# EAGLE design zigduino-v6c-test (EAGLE 6.3)
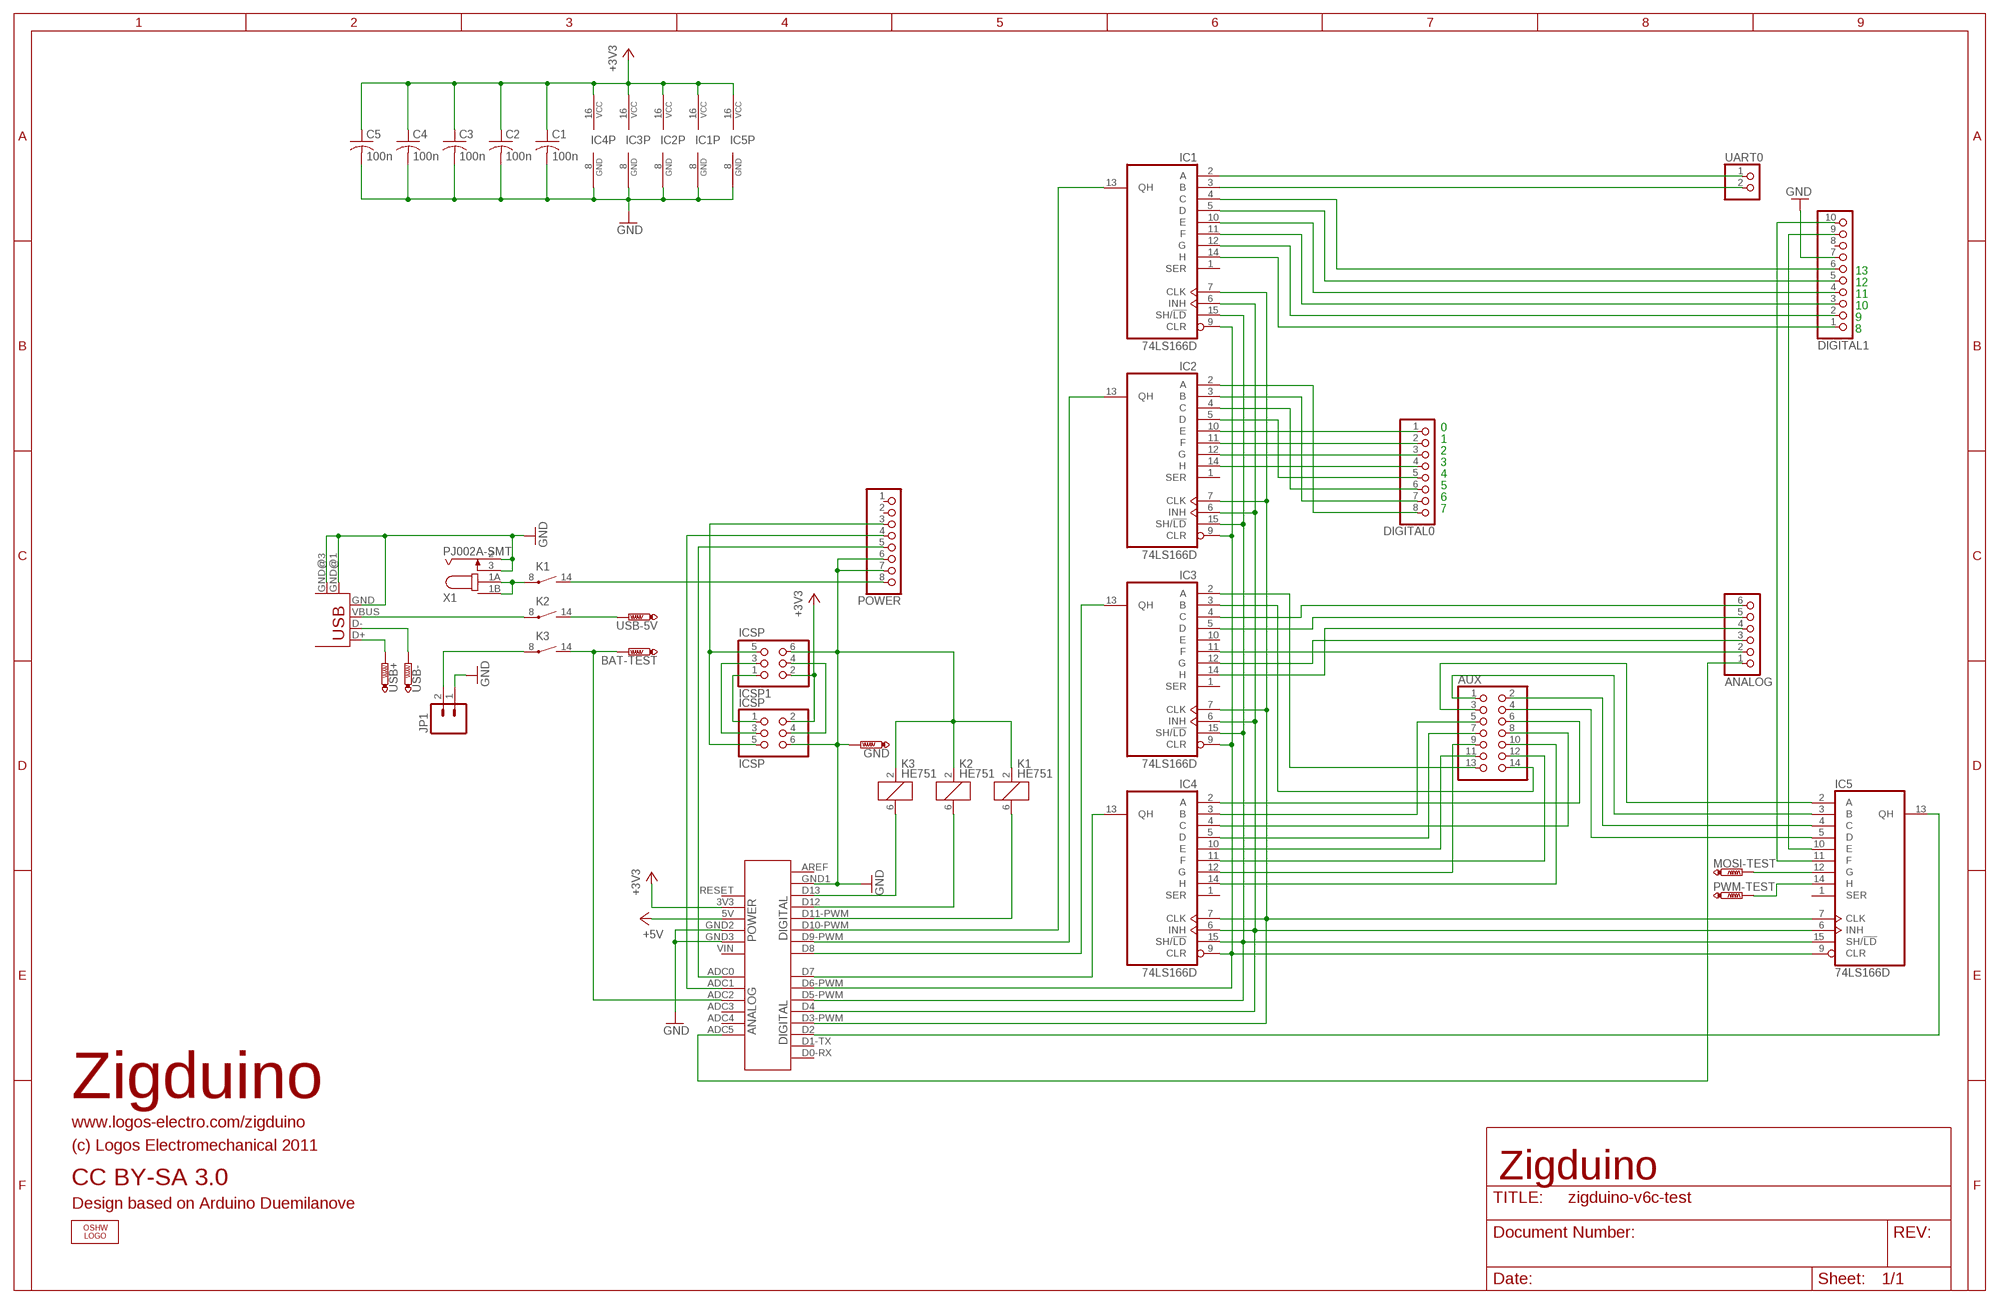
[diagram p0: schematic, sheet 1]

## Parts
ANALOG  PINHD-1X6  [1X06]
AUX  PINHD-2X7_2.00  [2X07M]
BAT-TEST  PTR1PAD1-13  [P1-13]
C1  100n  C-USC0603  [C0603]
C2  100n  C-USC0603  [C0603]
C3  100n  C-USC0603  [C0603]
C4  100n  C-USC0603  [C0603]
C5  100n  C-USC0603  [C0603]
DIGITAL0  PINHD-1X8  [1X08]
DIGITAL1  PINHD-1X10  [1X10]
GND  PTR1PAD1-13  [P1-13]
IC1  74LS166D  [SO16]
IC2  74LS166D  [SO16]
IC3  74LS166D  [SO16]
IC4  74LS166D  [SO16]
IC5  74LS166D  [SO16]
ICSP  ICSP  PINHD-2X3  [2X03]
ICSP1  ICSP  PINHD-2X3  [2X03]
JP1  M02-JST-2MM-SMT  [S2B-PH]
K1  HE751  [HE751]
K2  HE751  [HE751]
K3  HE751  [HE751]
LOGO1  OSHW_LOGO_FILLX0200-NT  [OSHW_FILLX200_NOTEXT]
MOSI-TEST  PTR1PAD1-13  [P1-13]
POWER  PINHD-1X8  [1X08]
PWM-TEST  PTR1PAD1-13  [P1-13]
SHIELD1  2009  [2009]
UART0  PINHD-1X2  [1X02]
USB1  USB-MB-S  [USB-MB-S]
USB+  PTR1PAD1-13  [P1-13]
USB-  PTR1PAD1-13  [P1-13]
USB-5V  PTR1PAD1-13  [P1-13]
X1  PJ002A-SMT  [PJ002A-SMT]

## Nets
+3V3: C1.1 C2.1 C3.1 C4.1 C5.1 IC1.16(VCC) IC2.16(VCC) IC3.16(VCC) IC4.16(VCC) IC5.16(VCC) ICSP1.2 ICSP.2 SHIELD1.3V3
+5V: SHIELD1.5V
GND: C1.2 C2.2 C3.2 C4.2 C5.2 DIGITAL1.7 GND.TP IC1.8(GND) IC2.8(GND) IC3.8(GND) IC4.8(GND) IC5.8(GND) ICSP1.6 ICSP.6 JP1.1 K1.2 K2.2 K3.2 POWER.6 POWER.7 SHIELD1.GND1 SHIELD1.GND2 SHIELD1.GND3 USB1.GND USB1.GND@1(GND) USB1.GND@3(GND) X1.2 X1.3
N$1: IC1.2(A) UART0.1
N$2: IC1.3(B) UART0.2
N$3: JP1.2 K3.8(2:P)
N$4: DIGITAL1.6 IC1.4(C)
N$5: DIGITAL1.5 IC1.5(D)
N$6: DIGITAL1.4 IC1.10(E)
N$7: DIGITAL1.3 IC1.11(F)
N$8: DIGITAL1.2 IC1.12(G)
N$9: DIGITAL1.1 IC1.14(H)
N$10: DIGITAL0.4 IC2.14(H)
N$11: DIGITAL0.3 IC2.12(G)
N$12: DIGITAL0.2 IC2.11(F)
N$13: DIGITAL0.1 IC2.10(E)
N$14: DIGITAL0.5 IC2.5(D)
N$15: DIGITAL0.6 IC2.4(C)
N$16: DIGITAL0.7 IC2.3(B)
N$17: DIGITAL0.8 IC2.2(A)
N$18: ANALOG.1 SHIELD1.ADC5
N$19: ANALOG.6 IC3.4(C)
N$20: ANALOG.5 IC3.5(D)
N$21: ANALOG.4 IC3.14(H)
N$22: ANALOG.3 IC3.12(G)
N$23: ANALOG.2 IC3.11(F)
N$24: AUX.13 IC3.2(A)
N$25: AUX.14 IC3.3(B)
N$26: AUX.6 IC4.2(A)
N$27: AUX.5 IC4.3(B)
N$28: AUX.8 IC4.4(C)
N$29: AUX.7 IC4.5(D)
N$30: AUX.11 IC4.10(E)
N$31: AUX.12 IC4.11(F)
N$32: AUX.9 IC4.12(G)
N$33: AUX.3 IC5.2(A)
N$34: AUX.10 IC4.14(H)
N$35: AUX.2 IC5.4(C)
N$36: AUX.4 IC5.5(D)
N$37: AUX.1 IC5.3(B)
N$38: IC1.9(CLR) IC2.9(CLR) IC3.9(CLR) IC4.9(CLR) IC5.9(CLR) SHIELD1.D6-PWM(D6)
N$39: IC1.15(SH/!LD) IC2.15(SH/!LD) IC3.15(SH/!LD) IC4.15(SH/!LD) IC5.15(SH/!LD) SHIELD1.D5-PWM(D5)
N$40: IC1.6(INH) IC2.6(INH) IC3.6(INH) IC4.6(INH) IC5.6(INH) SHIELD1.D4
N$41: IC1.7(CLK) IC2.7(CLK) IC3.7(CLK) IC4.7(CLK) IC5.7(CLK) SHIELD1.D3-PWM(D3)
N$42: DIGITAL1.9 IC5.10(E)
N$43: DIGITAL1.10 IC5.11(F)
N$44: IC5.12(G) MOSI-TEST.TP
N$45: IC5.14(H) PWM-TEST.TP
N$46: IC1.13(QH) SHIELD1.D10-PWM(D10)
N$47: IC2.13(QH) SHIELD1.D9-PWM(D9)
N$48: IC3.13(QH) SHIELD1.D8
N$49: IC4.13(QH) SHIELD1.D7
N$50: IC5.13(QH) SHIELD1.D2
N$51: POWER.5 SHIELD1.ADC0
N$52: POWER.4 SHIELD1.ADC1
N$53: K1.14(2:S) POWER.8
N$54: K2.14(2:S) USB-5V.TP
N$55: BAT-TEST.TP K3.14(2:S) SHIELD1.ADC2
N$56: K2.6 SHIELD1.D12
N$57: K1.6 SHIELD1.D11-PWM(D11)
N$58: ICSP1.4 ICSP.4
N$59: K3.6 SHIELD1.D13
N$60: ICSP1.1 ICSP.1
N$61: ICSP1.3 ICSP.3
N$62: ICSP1.5 ICSP.5 POWER.3
N$63: K2.8(2:P) USB1.VBUS
N$64: USB1.D+ USB+.TP
N$65: USB1.D- USB-.TP
N$66: K1.8(2:P) X1.1A X1.1B
Unconnected: DIGITAL1.8 IC1.1(SER) IC2.1(SER) IC3.1(SER) IC3.10(E) IC4.1(SER) IC5.1(SER) POWER.1 POWER.2 SHIELD1.ADC3 SHIELD1.ADC4 SHIELD1.AREF SHIELD1.D0-RX(D0) SHIELD1.D1-TX(D1) SHIELD1.RESET SHIELD1.VIN

## Notes on the sheet
- 13
- 12
- 11
- 10
- 9
- 8
- 0
- 1
- 2
- 3
- 4
- 5
- 6
- 7
- Zigduino
- www.logos-electro.com/zigduino
- (c) Logos Electromechanical 2011
- CC BY-SA 3.0 | Zigduino
- Design based on Arduino Duemilanove

## Library data of the parts
ANALOG = pinhead:PINHD-1X6: PIN HEADER; BOM: INCLUDE; DNP: T; PARTNO: 19742
AUX = pinhead-1:PINHD-2X7: PIN HEADER; DNP: T; PARTNO: 00217
BAT-TEST GND MOSI-TEST PWM-TEST USB+ USB- USB-5V = testpad:PTR1: TEST PIN; BOM: EXCLUDE; DNP: T; PARTNO: TP13
C1-C5 = resistor:C-US: CAPACITOR, American symbol
DIGITAL0 POWER = pinhead:PINHD-1X8: PIN HEADER; BOM: INCLUDE; DNP: T; PARTNO: 19743
DIGITAL1 = pinhead:PINHD-1X10: PIN HEADER; DNP: T; PARTNO: 20083
IC1-IC5 = 74xx-us:74*166: 8-bit parallel load SHIFT REGISTER
ICSP ICSP1 = pinhead:PINHD-2X3: PIN HEADER; BOM: INCLUDE; DNP: T; PARTNO: 961206-6404-AR
JP1 = SparkFun:M02: Header 2 Standard 2-pin 0.1" header. Use with straight break away headers (SKU : PRT-00116), right angle break away headers (PRT-00553), swiss pins (PRT-00743), machine pins (PRT-00117), and female headers (PRT-00115). Molex polarized connector foot print use with SKU : PRT-08233 with associated crimp pins and housings.
K1-K3 = relay:HE751: RELAY reed, 1 x norm. open, Hamlin
LOGO1 = OSHW:OSHW_LOGO_FILL; BOM: EXCLUDE; DNP: T
SHIELD1 = arduino-shields:2009
UART0 = pinhead:PINHD-1X2: PIN HEADER; BOM: INCLUDE; DNP: T; PARTNO: 00522
USB1 = con-usb-2:USB: USB Connectors
X1 = logos-headers:PJ002A

## Net classes
0 default: width 0.127 mm, drill 0.33 mm, clearance 0.127 mm
1 power: width 0.152 mm
2 gnd: width 0.152 mm
3 usbvcc: width 0.152 mm
4 aref: width 0.152 mm
5 rf: width 0.152 mm

## Board
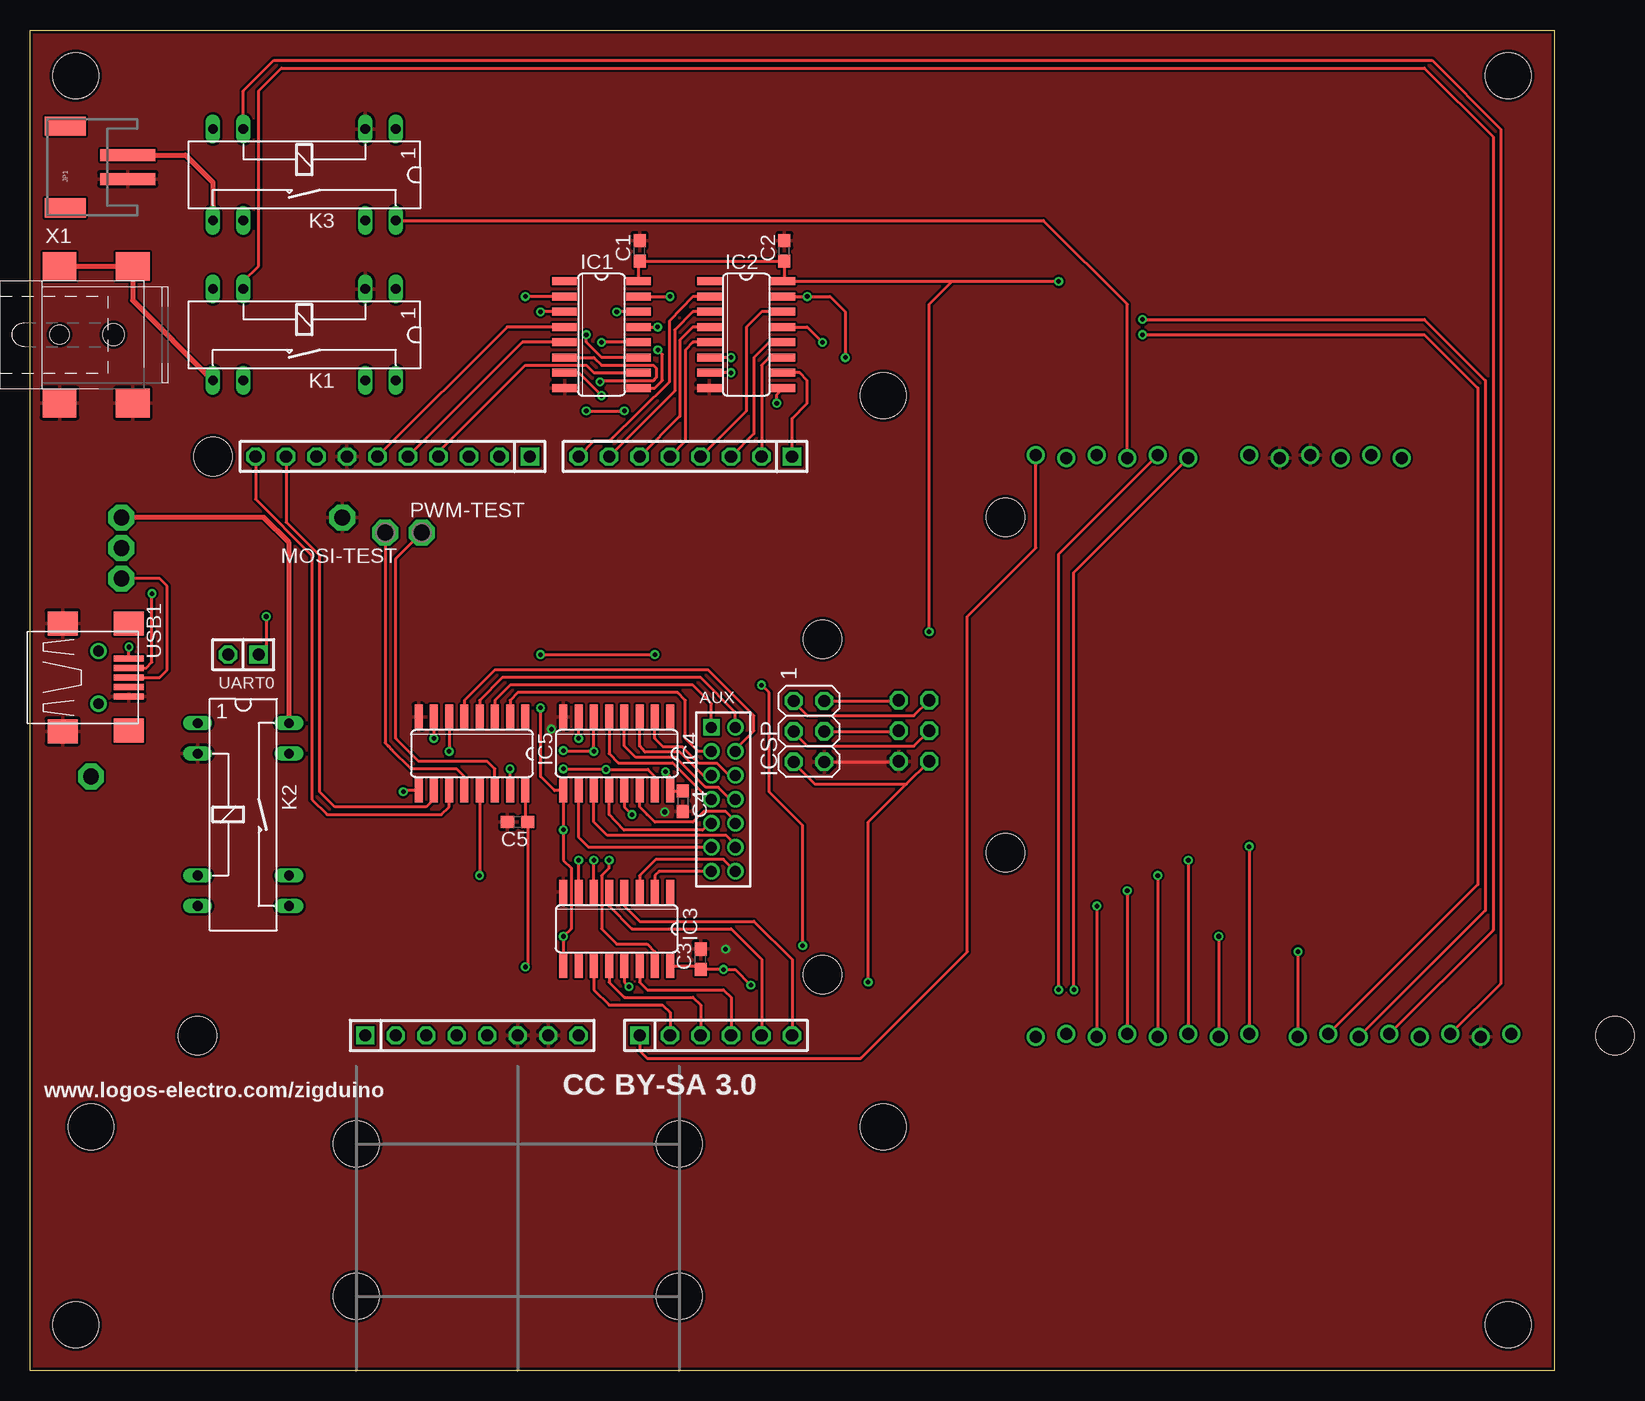
[diagram p1: board, top side]
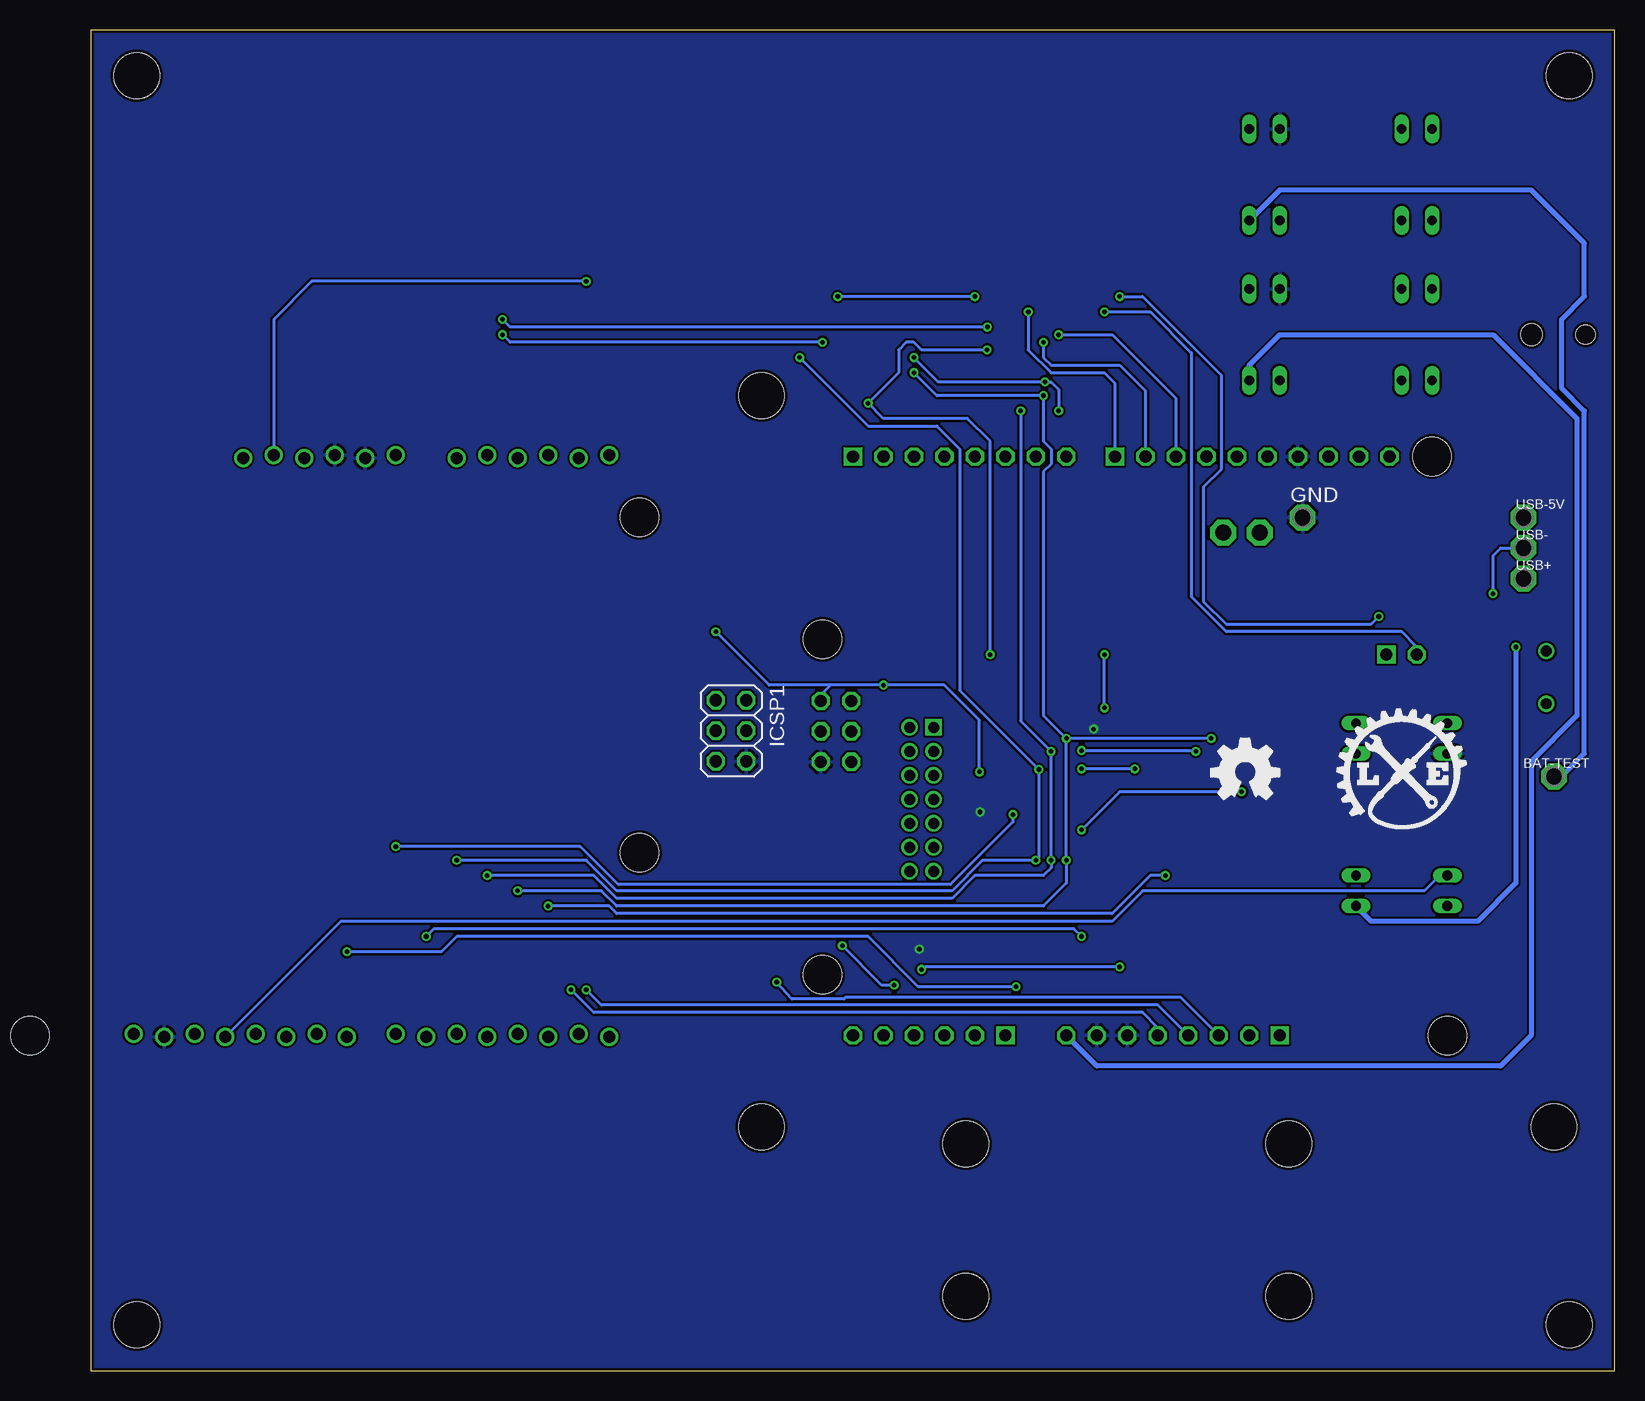
[diagram p2: board, bottom side, seen from below]

Size 127 x 111.76 mm. Coordinates in mm from the lower left corner, seen from the top.
Outline: 0,111.76 127,111.76 127,0 0,0 0,111.76
Copper layers (1*16): Top 0.0356mm / dielectric 1.5011mm / Bottom 0.0356mm
Design rules "default": minimum track width 7mil, minimum drill 13mil, track to track 7mil, track to pad 7mil, pad to pad 7mil, via to via 7mil, smd to smd 6mil, copper to edge 10mil, drill to drill 7mil, minimum pad ring 7mil, minimum via ring 7mil, stop-mask expansion 4mil, vias tented up to drill 0mil, thermal gap 10mil
Holes 3.2 mm at 66.04,60.96 66.04,33.02 15.24,76.2 13.97,27.94
Holes 3.81 mm at 27.18,18.9 54.1,18.9 54.1,6.2 27.18,6.2 5.08,20.32 71.12,20.32 71.12,81.28 3.81,107.95 123.19,107.95 123.19,3.81 3.81,3.81

### Footprints (pad centres in the part's own frame; a part is rotated, then mirrored left to right if it is on the bottom)
1X06 = drill 1.016 square: 1 -6.35,0 | drill 1.016 octagon: 2 -3.81,0; 3 -1.27,0; 4 1.27,0; 5 3.81,0; 6 6.35,0
2X07M = drill 0.914 square: 1 -6,-1 | drill 0.914: 2 -6,1; 3 -4,-1; 4 -4,1; 5 -2,-1; 6 -2,1; 7 0,-1; 8 0,1; 9 2,-1; 10 2,1; 11 4,-1; 12 4,1; 13 6,-1; 14 6,1
P1-13 = drill 1.321 pad 2.159 octagon: TP 0,0
C0603 = smd 1.1 x 1: 1 -0.85,0; 2 0.85,0
1X08 = drill 1.016 square: 1 -8.89,0 | drill 1.016 octagon: 2 -6.35,0; 3 -3.81,0; 4 -1.27,0; 5 1.27,0; 6 3.81,0; 7 6.35,0; 8 8.89,0
1X10 = drill 1.016 square: 1 -11.43,0 | drill 1.016 octagon: 2 -8.89,0; 3 -6.35,0; 4 -3.81,0; 5 -1.27,0; 6 1.27,0; 7 3.81,0; 8 6.35,0; 9 8.89,0; 10 11.43,0
SO16 = smd 0.66 x 2.032: 1 -4.445,-3.073; 2 -3.175,-3.073; 3 -1.905,-3.073; 4 -0.635,-3.073; 5 0.635,-3.073; 6 1.905,-3.073; 7 3.175,-3.073; 8 4.445,-3.073; 9 4.445,3.073; 10 3.175,3.073; 11 1.905,3.073; 12 0.635,3.073; 13 -0.635,3.073; 14 -1.905,3.073; 15 -3.175,3.073; 16 -4.445,3.073
2X03 = drill 1.016 octagon: 1 -2.54,-1.27; 2 -2.54,1.27; 3 0,-1.27; 4 0,1.27; 5 2.54,-1.27; 6 2.54,1.27
S2B-PH = smd 1 x 4.6: 1 -1,-3.7; 2 1,-3.7 | smd 1.6 x 3.4: NC1 -3.4,1.5; NC2 3.4,1.5
HE751 = drill 0.813 long: 1 -7.62,-3.81; 2 -5.08,-3.81; 6 5.08,-3.81; 7 7.62,-3.81; 8 7.62,3.81; 9 5.08,3.81; 13 -5.08,3.81; 14 -7.62,3.81
2009 = drill 1: 3V3 35.56,2.413; 5V 38.1,2.667; ADC0 50.8,2.667; ADC1 53.34,2.413; ADC2 55.88,2.667; ADC3 58.42,2.413; ADC4 60.96,2.667; ADC5 63.5,2.413; AREF 23.876,50.673; D0-RX 63.5,50.927; D1-TX 60.96,50.673; D2 58.42,50.927; D3-PWM 55.88,50.673; D4 53.34,50.927; D5-PWM 50.8,50.673; D6-PWM 48.26,50.927; D7 45.72,50.673; D8 41.656,50.927; D9-PWM 39.116,50.673; D10-PWM 36.576,50.927; D11-PWM 34.036,50.673; D12 31.496,50.927; D13 28.956,50.673; GND1 26.416,50.927; GND2 40.64,2.413; GND3 43.18,2.667; RESET 33.02,2.667; VIN 45.72,2.413 | hole 3.2: 15.24,50.8; 66.04,35.56; 66.04,7.62
1X02 = drill 1.016 square: 1 -1.27,0 | drill 1.016 octagon: 2 1.27,0
USB-MB-S = smd 2.5 x 0.5: D+ 2.5,0; D- 2.5,0.8; GND 2.5,-1.6; ID 2.5,-0.8; VBUS 2.5,1.6 | smd 2.5 x 2: GND@1 -3,4.5; GND@2 2.5,4.5; GND@3 -3,-4.5; GND@4 2.5,-4.4 | drill 0.9: P$5 0,2.2; P$6 0,-2.2
PJ002A-SMT = smd 2.8 x 2.4: 1A 5,5.7; 1B 11.1,5.7; 2 5,-5.7; 3 11.1,-5.7 | hole 1.6: 5,0 | hole 1.8: 9.5,0

### Placement (x,y rotation side)
ANALOG  57.15,27.94 0 top
AUX  57.78,47.62 270 top
BAT-TEST  5.08,49.53 270 bottom
C1  50.8,93.34 90 top
C2  62.87,93.34 90 top
C3  55.88,34.29 90 top
C4  54.39,47.47 270 top
C5  40.64,45.72 180 top
DIGITAL0  54.61,76.2 180 top
DIGITAL1  30.23,76.2 180 top
GND  26.04,71.12 0 bottom
IC1  47.62,86.36 270 top
IC2  59.69,86.36 270 top
IC3  48.9,36.83 180 top
IC4  48.9,51.44 180 top
IC5  36.83,51.44 180 top
ICSP  64.91,53.29 270 top
ICSP1  73.66,53.34 270 bottom
JP1  4.45,100.33 90 top
K1  22.86,86.36 180 top
K2  17.78,46.35 270 top
K3  22.86,99.69 180 top
LOGO1  33.66,47.62 0 bottom
MOSI-TEST  29.59,69.85 180 top
POWER  36.83,27.94 0 top
PWM-TEST  32.64,69.85 0 top
SHIELD1  147.32,78.74 180 top
U$4  [LOGO-SM]  23.62,44.83 0 bottom
UART0  17.78,59.69 180 top
USB1  5.71,57.78 0 top
USB+  7.62,66.04 0 bottom
USB-  7.62,68.58 0 bottom
USB-5V  7.62,71.12 0 bottom
X1  -2.54,86.36 0 top

### Tracks (layer width: path | path; a pad name or v marks a point on that pad's centre or on a via)
+3V3  (via drill 0.38)
  Top 0.254: ICSP.2 72.34,55.83 ICSP1.2 | C4.1 53.57,48.32 IC4.16 53.34,49.53 v52.96,49.91 | IC1.16 50.7,92.5 C1.1 C2.1 62.87,90.91 IC2.16 76.83,90.81 | 76.83,90.81 v85.72,90.81 | v74.93,61.59 74.93,88.9 76.83,90.81 | v60.07,32.13 58.76,33.44 v57.78,33.44 C3.1 55.56,33.76 IC3.16 | v64.39,35.43 64.39,45.47 61.59,48.26 61.59,56.52 v60.96,57.15 | v41.27,33.66 41.49,33.87 C5.1 41.27,45.94 IC5.16
  Bottom 0.254: v85.72,90.81 108.58,90.81 111.76,87.63 SHIELD1.3V3 | v52.96,49.91 52.96,54.23 55.88,57.15 v60.96,57.15 65.36,57.15 | 65.36,57.15 66.67,55.83 ICSP.2 | 65.36,57.15 70.48,57.15 v74.93,61.59 | v60.07,32.13 61.09,32.13 v64.39,35.43 | v41.27,33.66 57.57,33.66 v57.78,33.44
GND  (via drill 0.38)
  Top 0.254: ICSP.6 72.34,50.75 ICSP1.6
  other vias: 52.9,46.57 43.45,53.48 57.98,35.14
  pour Top (rank 2): 0,111.76 127,111.76 127,0 0,0
  pour Bottom (rank 3): 0,111.76 127,111.76 127,0 0,0
N$1  (via drill 0.38)
  Top 0.254: IC1.2 v41.27,89.53 | v19.68,62.87 19.68,60.32 UART0.1
  Bottom 0.254: v41.27,89.53 39.37,89.53 32.83,82.99 32.83,75.12 34.29,73.66 34.29,64.13 32.38,62.23 20.32,62.23 v19.68,62.87
N$2  (via drill 0.38)
  Top 0.254: IC1.3 v42.55,88.27
  Bottom 0.254: v42.55,88.27 38.73,88.27 35.31,84.84 35.31,64.52 32.38,61.59 17.78,61.59 16.51,60.32 UART0.2
N$3
  Top 0.406: JP1.2 12.97,101.33 15.24,99.06 K3.8
N$4
  Top 0.254: IC1.4 39.75,87 DIGITAL1.6
N$5
  Top 0.254: IC1.5 41.02,85.72 DIGITAL1.5
N$6
  Top 0.254: DIGITAL1.4 34.04,76.58 41.27,83.82 46.35,83.82 46.99,83.19 IC1.10
N$7  (via drill 0.38)
  Top 0.254: IC1.11 47.62,84.45 46.35,85.72 v46.35,86.36
  Bottom 0.254: v46.35,86.36 41.91,86.36 36.58,81.03 DIGITAL1.3
N$8  (via drill 0.38)
  Top 0.254: IC1.12 v47.62,85.72
  Bottom 0.254: v47.62,85.72 47.62,84.45 46.99,83.82 41.27,83.82 39.12,81.66 DIGITAL1.2
N$9  (via drill 0.38)
  Top 0.254: IC1.14 v48.9,88.27
  Bottom 0.254: v48.9,88.27 48.9,85.09 46.99,83.19 42.55,83.19 41.66,82.3 DIGITAL1.1
N$10
  Top 0.254: IC2.14 60.96,88.27 59.69,87 59.69,80.01 DIGITAL0.4
N$11
  Top 0.254: IC2.12 61.59,85.72 60.33,84.45 60.33,78.1 DIGITAL0.3
N$12
  Top 0.254: IC2.11 61.59,84.45 60.96,83.82 DIGITAL0.2
N$13
  Top 0.254: DIGITAL0.1 63.5,79.38 64.77,80.64 64.77,82.55 64.14,83.19 IC2.10
N$14
  Top 0.254: IC2.5 55.24,85.72 54.61,85.09 54.61,77.47 DIGITAL0.5
N$15
  Top 0.254: IC2.4 55.24,87 54.17,85.92 54.17,79.57 DIGITAL0.6
N$16
  Top 0.254: IC2.3 55.24,88.27 53.72,86.74 53.72,81.66 DIGITAL0.7
N$17
  Top 0.254: IC2.2 55.24,89.53 53.28,87.5 53.28,82.42 48.26,77.47 46.99,77.47 DIGITAL0.8
N$18
  Top 0.254: ANALOG.1 50.8,26.67 51.44,26.04 69.22,26.04 78.11,34.92 78.11,62.87 83.82,68.58 SHIELD1.ADC5
N$19
  Top 0.254: IC3.4 49.53,38.73 50.8,37.46 60.33,37.46 63.5,34.29 ANALOG.6
N$20
  Top 0.254: IC3.5 48.26,38.73 50.16,36.83 58.42,36.83 60.96,34.29 ANALOG.5
N$21
  Top 0.254: IC3.14 50.8,32.38 51.44,31.75 57.78,31.75 58.42,31.11 ANALOG.4
N$22
  Top 0.254: IC3.12 48.26,32.38 49.53,31.11 55.24,31.11 55.88,30.48 ANALOG.3
N$23
  Top 0.254: IC3.11 46.99,31.75 48.26,30.48 52.7,30.48 53.34,29.84 ANALOG.2
N$24
  Top 0.254: AUX.13 52.42,41.62 52.07,41.27 IC3.2
N$25
  Top 0.254: IC3.3 50.8,41.27 52.16,42.62 57.78,42.62 AUX.14
N$26
  Top 0.254: AUX.6 58.26,49.62 57.26,50.62 55.74,50.62 54.36,52.01 52.77,52.01 52.07,52.7 IC4.2
N$27
  Top 0.254: AUX.5 56.1,49.62 54.17,51.56 51.24,51.56 50.8,52.07 IC4.3
N$28
  Top 0.254: AUX.8 58.36,47.62 57.37,48.62 56.33,48.62 53.82,51.12 50.48,51.12 49.53,52.07 IC4.4
N$29
  Top 0.254: IC4.5 48.26,51.44 49.02,50.67 53.55,50.67 53.73,50.48 56.59,47.62 AUX.7
N$30
  Top 0.254: AUX.11 46.55,43.62 45.72,44.45 IC4.10
N$31
  Top 0.254: AUX.12 58.78,43.83 58.01,44.62 48.11,44.62 46.99,45.72 IC4.11
N$32
  Top 0.254: AUX.9 56.61,45.62 56.06,45.07 49.49,45.07 48.26,46.35 IC4.12
N$33
  Top 0.254: AUX.3 55.69,51.62 54.61,52.7 54.61,55.88 53.98,56.52 40.64,56.52 40.01,55.88 IC5.2
N$34
  Top 0.254: AUX.10 58.78,45.8 57.98,46.62 56.15,46.62 55.24,45.72 52.07,45.72 51.44,46.35 51.18,46.62 50.8,46.99 IC4.14
N$35
  Top 0.254: AUX.2 58.78,54.88 55.88,57.78 39.37,57.78 37.47,55.88 IC5.4
N$36
  Top 0.254: AUX.4 58.78,51.8 60.33,53.34 60.33,54.61 56.52,58.42 38.73,58.42 36.2,55.88 IC5.5
N$37
  Top 0.254: AUX.1 56.78,55.61 55.24,57.15 40.01,57.15 38.73,55.88 IC5.3
N$38  (via drill 0.38)
  Top 0.254: IC3.9 v44.45,36.2 45.09,36.83 45.09,41.91 44.45,42.55 v44.45,45.08 IC4.9 43.71,48.36 42.55,49.53 v42.55,55.24 | IC1.9 52.07,81.91 52.7,82.55 52.7,84.71 v52.32,85.09 | v62.23,80.64 62.23,81.38 IC2.9 | IC5.9 31.22,48.36 v31.11,48.26 | v42.55,59.69 v52.07,59.69 | v99.06,36.2 SHIELD1.D6-PWM
  Bottom 0.254: v52.32,85.09 57.78,85.09 58.42,85.72 59.05,85.72 59.69,85.09 59.69,83.19 v62.23,80.64 60.96,79.38 53.98,79.38 52.07,77.47 v52.07,59.69 | v31.11,48.26 41.27,48.26 v44.45,45.08 | v42.55,55.24 v42.55,59.69 | v44.45,36.2 45.09,36.83 98.42,36.83 v99.06,36.2
N$39  (via drill 0.38)
  Top 0.254: IC1.15 v53.34,89.53 | IC4.15 52.07,49.53 51.49,50.11 v48.01,50.11 47.95,50.16 v44.45,50.16 | IC2.15 v64.77,89.53 66.67,89.53 67.94,88.27 v67.94,84.45 | IC5.15 v40.01,50.16 | IC3.15 52.07,34.92 51.44,35.56 48.9,35.56 47.62,36.83 47.62,41.27 48.26,41.91 v48.26,42.55 | v96.52,42.55 SHIELD1.D5-PWM
  Bottom 0.254: v53.34,89.53 v64.77,89.53 | v40.01,50.16 v44.45,50.16 | v67.94,84.45 62.23,78.74 56.52,78.74 54.61,76.84 54.61,56.72 v48.01,50.11 48.01,42.8 v48.26,42.55 52.7,42.55 55.24,40 83.19,40 85.72,42.55 v96.52,42.55
N$40  (via drill 0.38)
  Top 0.254: IC5.6 v34.92,51.63 | IC4.6 v46.99,51.63 44.51,51.63 v44.45,51.69 | v58.42,84.45 IC2.6 | v46.35,80.01 v49.53,80.01 | IC1.6 46.99,84.45 47.62,83.82 51.94,83.82 52.2,83.57 52.2,82.8 51.94,82.55 47.75,82.55 47.62,82.42 v47.5,82.42 | IC3.6 v46.99,42.55 | v93.98,41.27 SHIELD1.D4
  Bottom 0.254: v58.42,84.45 56.39,82.42 v47.5,82.42 46.99,82.42 46.35,81.79 v46.35,80.01 | v49.53,80.01 49.53,54.16 v46.99,51.63 v46.99,42.55 46.99,41.91 47.62,41.27 53.34,41.27 55.24,39.37 83.19,39.37 85.09,41.27 v93.98,41.27 | v44.45,51.69 34.99,51.69 v34.92,51.63
N$41  (via drill 0.38)
  Top 0.254: IC5.7 v33.66,52.7 | v45.72,52.7 IC4.7 | IC1.7 45.72,83.19 v47.62,81.28 | v58.42,83.19 IC2.7 | IC3.7 v45.72,42.55 | v91.44,40 SHIELD1.D3-PWM
  Bottom 0.254: v33.66,52.7 v45.72,52.7 | v45.72,52.7 v45.72,42.55 45.72,40.64 47.62,38.73 83.19,38.73 84.45,40 v91.44,40 | v58.42,83.19 56.52,81.28 v47.62,81.28 47.62,77.47 46.99,76.84 46.99,75.56 47.62,74.93 47.62,54.61 v45.72,52.7
N$42
  Top 0.254: IC5.10 33.66,47.62 33.02,46.99 25.4,46.99 24.13,48.26 24.13,67.94 21.34,70.74 DIGITAL1.9
N$43
  Top 0.254: DIGITAL1.10 18.8,72.64 23.5,67.94 23.5,47.62 24.77,46.35 34.29,46.35 34.92,46.99 IC5.11
N$44
  Top 0.254: IC5.12 36.2,49.53 35.56,50.16 31.75,50.16 30.16,51.75 29.84,52.07 29.59,52.32 MOSI-TEST.TP
N$45
  Top 0.254: IC5.14 38.73,50.16 38.1,50.8 32.38,50.8 30.48,52.7 30.48,67.69 PWM-TEST.TP
N$46  (via drill 0.38)
  Top 0.254: IC1.13 v52.3,87 | v92.71,87.63 116.2,87.63 121.28,82.55 121.28,38.35 SHIELD1.D10-PWM
  Bottom 0.254: v52.3,87 92.08,87 v92.71,87.63
N$47  (via drill 0.38)
  Top 0.254: v92.71,86.36 116.2,86.36 120.65,81.91 120.65,40.51 SHIELD1.D9-PWM | IC2.13 64.77,87 v66.04,85.72
  Bottom 0.254: v66.04,85.72 92.08,85.72 v92.71,86.36
N$48  (via drill 0.38)
  Top 0.254: IC3.13 49.53,32.38 v49.91,32 | v105.66,34.92 SHIELD1.D8
  Bottom 0.254: v49.91,32 58.04,32 62.23,36.2 96.52,36.2 97.79,34.92 v105.66,34.92
N$49  (via drill 0.38)
  Top 0.254: IC4.13 49.53,46.99 v50.16,46.35 | v101.6,43.69 SHIELD1.D7
  Bottom 0.254: v50.16,46.35 50.16,45.72 55.37,40.51 83.06,40.51 86.23,43.69 v101.6,43.69
N$50  (via drill 0.38)
  Top 0.254: IC5.13 v37.47,41.27 | v88.9,38.73 SHIELD1.D2
  Bottom 0.254: v37.47,41.27 38.73,41.27 41.91,38.1 83.19,38.1 83.82,38.73 v88.9,38.73
N$51  (via drill 0.38)
  Top 0.254: v87,31.75 87,66.55 SHIELD1.ADC0
  Bottom 0.254: POWER.5 38.1,28.57 39.37,29.84 85.09,29.84 v87,31.75
N$52  (via drill 0.38)
  Top 0.254: v85.72,31.75 85.72,68.07 SHIELD1.ADC1
  Bottom 0.254: POWER.4 38.1,30.48 84.45,30.48 v85.72,31.75
N$53
  Bottom 0.406: K1.14 30.48,83.82 27.94,86.36 10.16,86.36 3.17,79.38 3.17,54.61 6.99,50.8 6.99,27.94 9.53,25.4 43.18,25.4 POWER.8
N$54
  Top 0.406: K2.14 21.59,69.02 19.49,71.12 USB-5V.TP
N$55
  Top 0.254: K3.14 84.45,95.88 91.44,88.9 SHIELD1.ADC2
  Bottom 0.406: BAT-TEST.TP 4.45,49.53 2.54,51.44 2.54,80.01 4.45,81.91 4.45,87.63 2.54,89.53 2.54,93.98 6.99,98.43 27.94,98.43 K3.14
N$56
  Bottom 0.254: K2.6 14.61,41.27 15.88,40 39.37,40 41.91,37.46 106.17,37.46 SHIELD1.D12
N$57
  Top 0.254: K1.6 17.78,90.81 19.05,92.07 19.05,106.68 20.95,108.59 116.2,108.59 121.92,102.87 121.92,36.7 SHIELD1.D11-PWM
N$58
  Top 0.254: ICSP.4 72.34,53.29 ICSP1.4
N$59
  Top 0.254: K3.6 17.78,106.68 20.32,109.22 116.84,109.22 122.56,103.5 122.56,32.26 SHIELD1.D13
N$60
  Top 0.254: ICSP.1 63.64,55.74 64.77,54.61 73.66,54.61 ICSP1.1
N$61
  Top 0.254: ICSP.3 63.64,53.2 64.77,52.07 73.66,52.07 ICSP1.3
N$62  (via drill 0.38)
  Top 0.254: ICSP.5 63.64,50.66 65.41,48.89 73.03,48.89 | 73.03,48.89 ICSP1.5 | v69.85,32.38 69.85,45.72 73.03,48.89
  Bottom 0.254: POWER.3 36.2,31.11 64.14,31.11 64.26,30.99 68.58,30.99 v69.85,32.38
N$63  (via drill 0.38)
  Top 0.254: USB1.VBUS 8.21,60.28 v8.26,60.32
  Bottom 0.406: v8.26,60.32 8.26,40.64 11.43,37.46 20.32,37.46 K2.8
N$64
  Top 0.254: USB1.D+ 10.79,57.78 11.43,58.42 11.43,65.41 10.79,66.04 USB+.TP
N$65  (via drill 0.38)
  Top 0.254: USB1.D- 9.69,58.59 10.16,59.05 v10.16,64.77
  Bottom 0.254: v10.16,64.77 10.16,67.94 9.53,68.58 USB-.TP
N$66
  Top 0.406: X1.1A X1.1B 8.56,89.23 K1.8

### Text on the board
tNames: 1 | CC BY-SA 3.0 | www.logos-electro.com/zigduino
Reference: C8 | R7 | R5 | R6 | R4 | C3 | C2 | R9 | R8 | R1 | R2 | C1 | C4 | C5 | X2 | C7 | C6